# EAGLE schematic se2 (EAGLE 7.2.0)
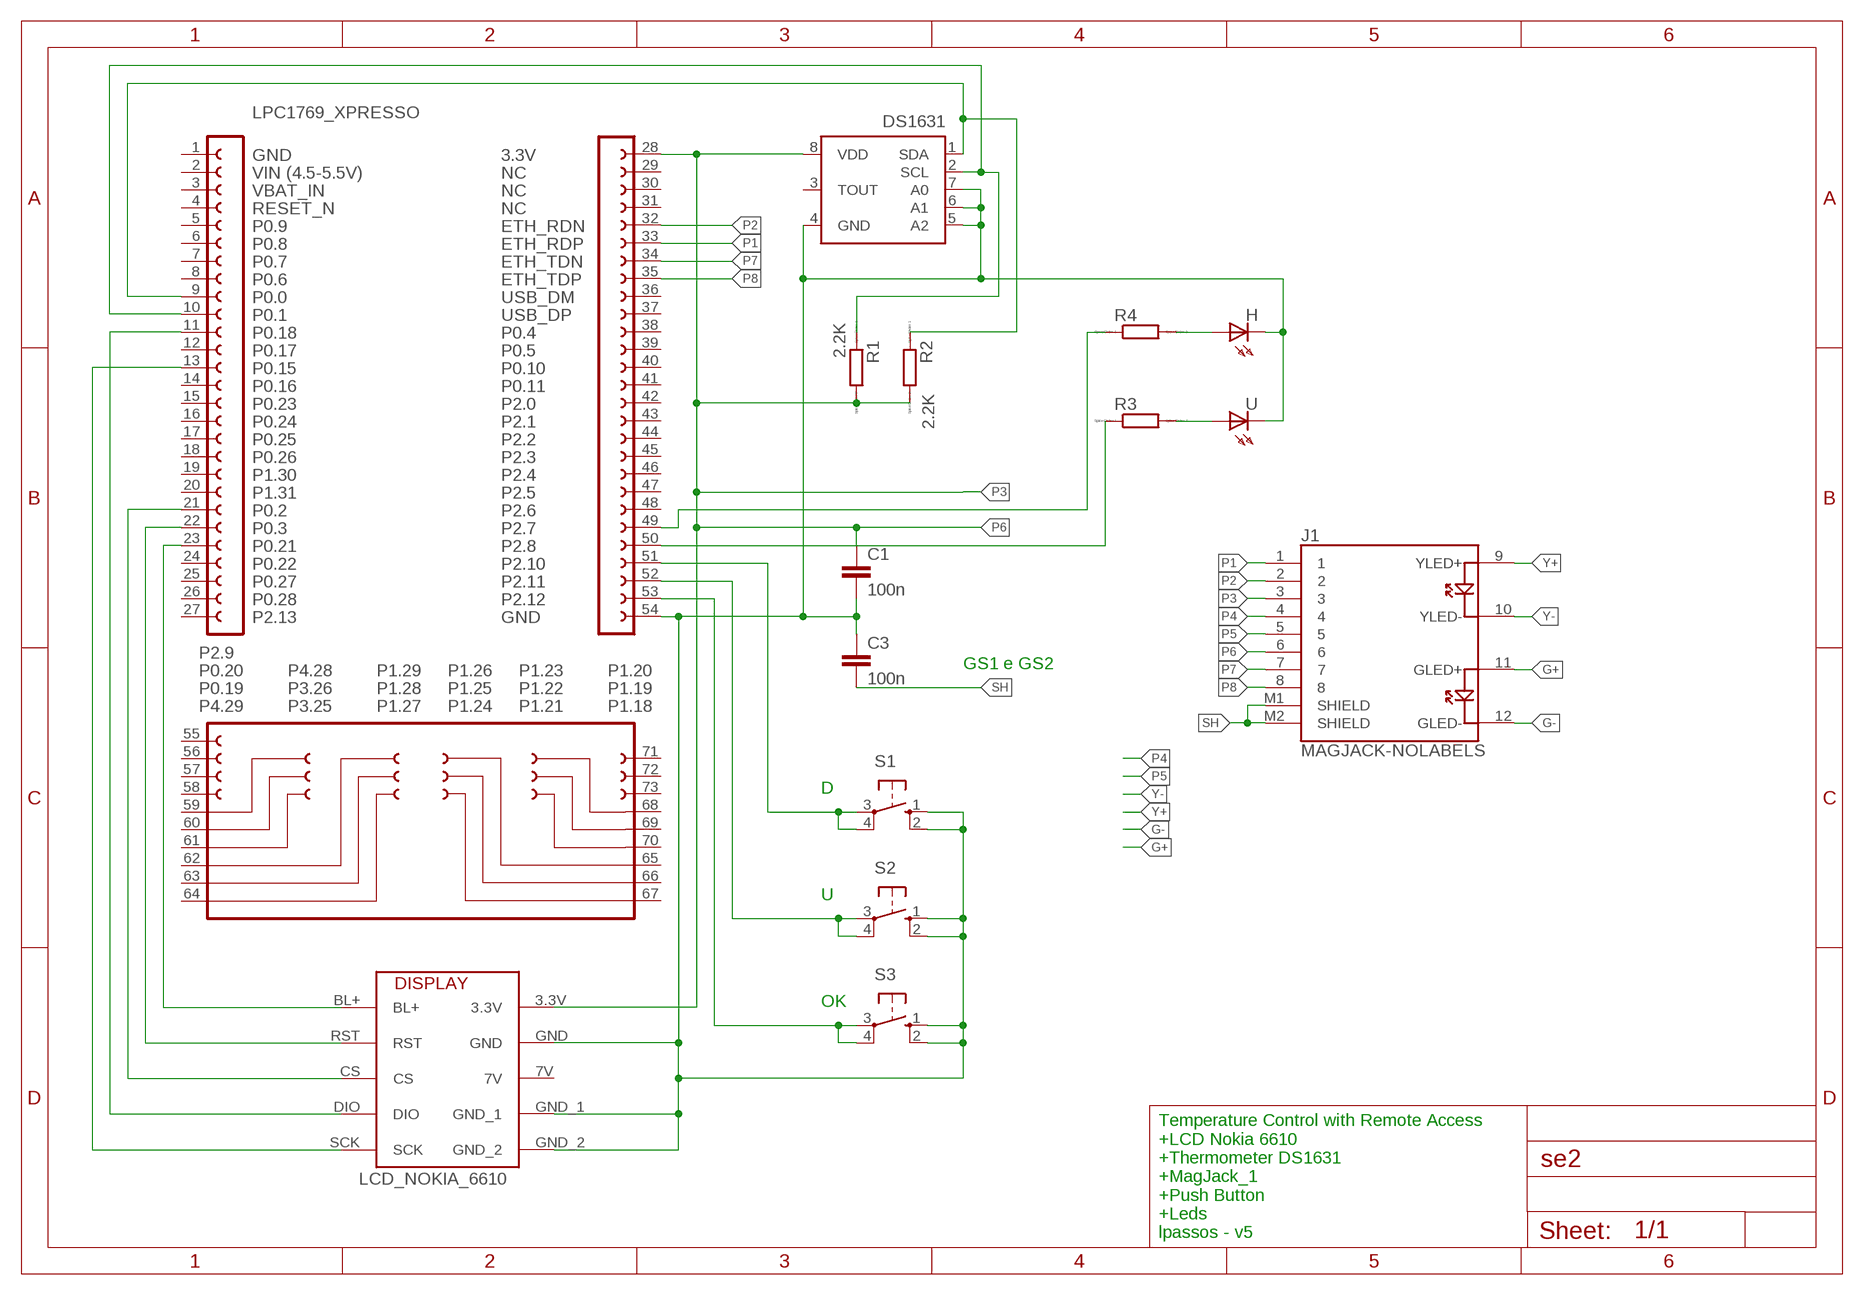
[diagram p0: schematic, sheet 1]

## Parts
C1  100n  C2,5-3  [C2.5-3]
C3  100n  C2,5-3  [C2.5-3]
DISPLAY  NOKIA_LCD_6610  [LCD_NOKIA_6610]
DS1631  DS1621  [DIL08]
H  HLMP6  [HLMP6]
J1  MAGJACK-NOLABELS  [MAGJACK]
LPC1769_XPRESSO  LPCXPRESSO_LPC1769  [LPCXPRESSO_LPC1769]
R1  2.2K  R  [R0805]
R2  2.2K  R  [R0805]
R3  R  [R0805]
R4  R  [R0805]
S1  10-XX  [B3F-10XX]
S2  10-XX  [B3F-10XX]
S3  10-XX  [B3F-10XX]
U  HLMP6  [HLMP6]

## Nets
G+: J1.11(GLED+)
G-: J1.12(GLED-)
N$1: LPC1769_XPRESSO.51 S1.3(P) S1.4(P1)
N$2: LPC1769_XPRESSO.53 S3.3(P) S3.4(P1)
N$3: H.A R4.2
N$4: DISPLAY.BL+ LPC1769_XPRESSO.23
N$5: DISPLAY.RST LPC1769_XPRESSO.22
N$6: DISPLAY.CS LPC1769_XPRESSO.21
N$7: DISPLAY.DIO LPC1769_XPRESSO.11
N$8: DISPLAY.SCK LPC1769_XPRESSO.13
N$9: C1.2 C3.1 DISPLAY.GND DISPLAY.GND_1 DISPLAY.GND_2 DS1631.4(GND) DS1631.5(A2) DS1631.6(A1) DS1631.7(A0) H.K LPC1769_XPRESSO.54 S1.1(S) S1.2(S1) S2.1(S) S2.2(S1) S3.1(S) S3.2(S1) U.K
N$10: DS1631.1(SDA) LPC1769_XPRESSO.9 R2.1
N$11: DS1631.2(SCL) LPC1769_XPRESSO.10 R1.1
N$12: LPC1769_XPRESSO.52 S2.3(P) S2.4(P1)
N$13: R3.2 U.A
N$14: LPC1769_XPRESSO.50 R3.1
N$15: LPC1769_XPRESSO.49 R4.1
P1: J1.1 LPC1769_XPRESSO.33
P2: J1.2 LPC1769_XPRESSO.32
P3: J1.3
P4: J1.4
P5: J1.5
P6: C1.1 DISPLAY.3.3V DS1631.8(VDD) J1.6 LPC1769_XPRESSO.28 R1.2 R2.2
P7: J1.7 LPC1769_XPRESSO.34
P8: J1.8 LPC1769_XPRESSO.35
SH: C3.2 J1.M1(SHIELD) J1.M2(SHIELD)
Y+: J1.9(YLED+)
Y-: J1.10(YLED-)
Unconnected: DISPLAY.7V DS1631.3(TOUT) LPC1769_XPRESSO.1 LPC1769_XPRESSO.2 LPC1769_XPRESSO.3 LPC1769_XPRESSO.4 LPC1769_XPRESSO.5 LPC1769_XPRESSO.6 LPC1769_XPRESSO.7 LPC1769_XPRESSO.8 LPC1769_XPRESSO.12 LPC1769_XPRESSO.14 LPC1769_XPRESSO.15 LPC1769_XPRESSO.16 LPC1769_XPRESSO.17 LPC1769_XPRESSO.18 LPC1769_XPRESSO.19 LPC1769_XPRESSO.20 LPC1769_XPRESSO.24 LPC1769_XPRESSO.25 LPC1769_XPRESSO.26 LPC1769_XPRESSO.27 LPC1769_XPRESSO.29 LPC1769_XPRESSO.30 LPC1769_XPRESSO.31 LPC1769_XPRESSO.36 LPC1769_XPRESSO.37 LPC1769_XPRESSO.38 LPC1769_XPRESSO.39 LPC1769_XPRESSO.40 LPC1769_XPRESSO.41 LPC1769_XPRESSO.42 LPC1769_XPRESSO.43 LPC1769_XPRESSO.44 LPC1769_XPRESSO.45 LPC1769_XPRESSO.46 LPC1769_XPRESSO.47 LPC1769_XPRESSO.48 LPC1769_XPRESSO.55 LPC1769_XPRESSO.56 LPC1769_XPRESSO.57 LPC1769_XPRESSO.58 LPC1769_XPRESSO.59 LPC1769_XPRESSO.60 LPC1769_XPRESSO.61 LPC1769_XPRESSO.62 LPC1769_XPRESSO.63 LPC1769_XPRESSO.64 LPC1769_XPRESSO.65 LPC1769_XPRESSO.66 LPC1769_XPRESSO.67 LPC1769_XPRESSO.68 LPC1769_XPRESSO.69 LPC1769_XPRESSO.70 LPC1769_XPRESSO.71 LPC1769_XPRESSO.72 LPC1769_XPRESSO.73

## Notes on the sheet
- GS1 e GS2
- D
- U
- OK
- Temperature Control with Remote Access
  +LCD Nokia 6610
  +Thermometer DS1631
  +MagJack_1
  +Push Button
  +Leds
  lpassos - v5

## Library data of the parts
C1 C3 = capacitor-wima:C: CAPACITOR naming: grid - package width
DISPLAY = nokia_lcd6610:NOKIA_LCD_6610
DS1631 = maxim:DS1621: Digital Thermometer and Thermostat Source: http://pdfserv.maxim-ic.com/en/ds/DS1621.pdf; MPN: DS1621; OC_FARNELL: 1188024; OC_NEWARK: 66F3769
H U = display-hp:HLMP6: LED 2mm horizontal; MF: AGILENT TECHNOLOGIES; MPN: HLMP-6500; OC_FARNELL: 1652490; OC_NEWARK: 40K0088
J1 = SparkFun-Connectors:MAGJACK-NOLABELS; PROD_ID: CONN-09556
LPC1769_XPRESSO = LPCXpresso_boards:LPCXPRESSO_LPC1769; OC_NEWARK: unknown
R1-R4 = eagle-ltspice:R: RESISTOR, European symbol; SPICEMODEL: NONE; SPICEPREFIX: R
S1-S3 = switch-omron:10-XX: OMRON SWITCH; MPN: B3F-1000; OC_FARNELL: 176432; OC_NEWARK: 36M3542